# Altium schematic sheet SWDM-21DD8_LV_XX_V1.SchDoc
size 419 x 297 mm
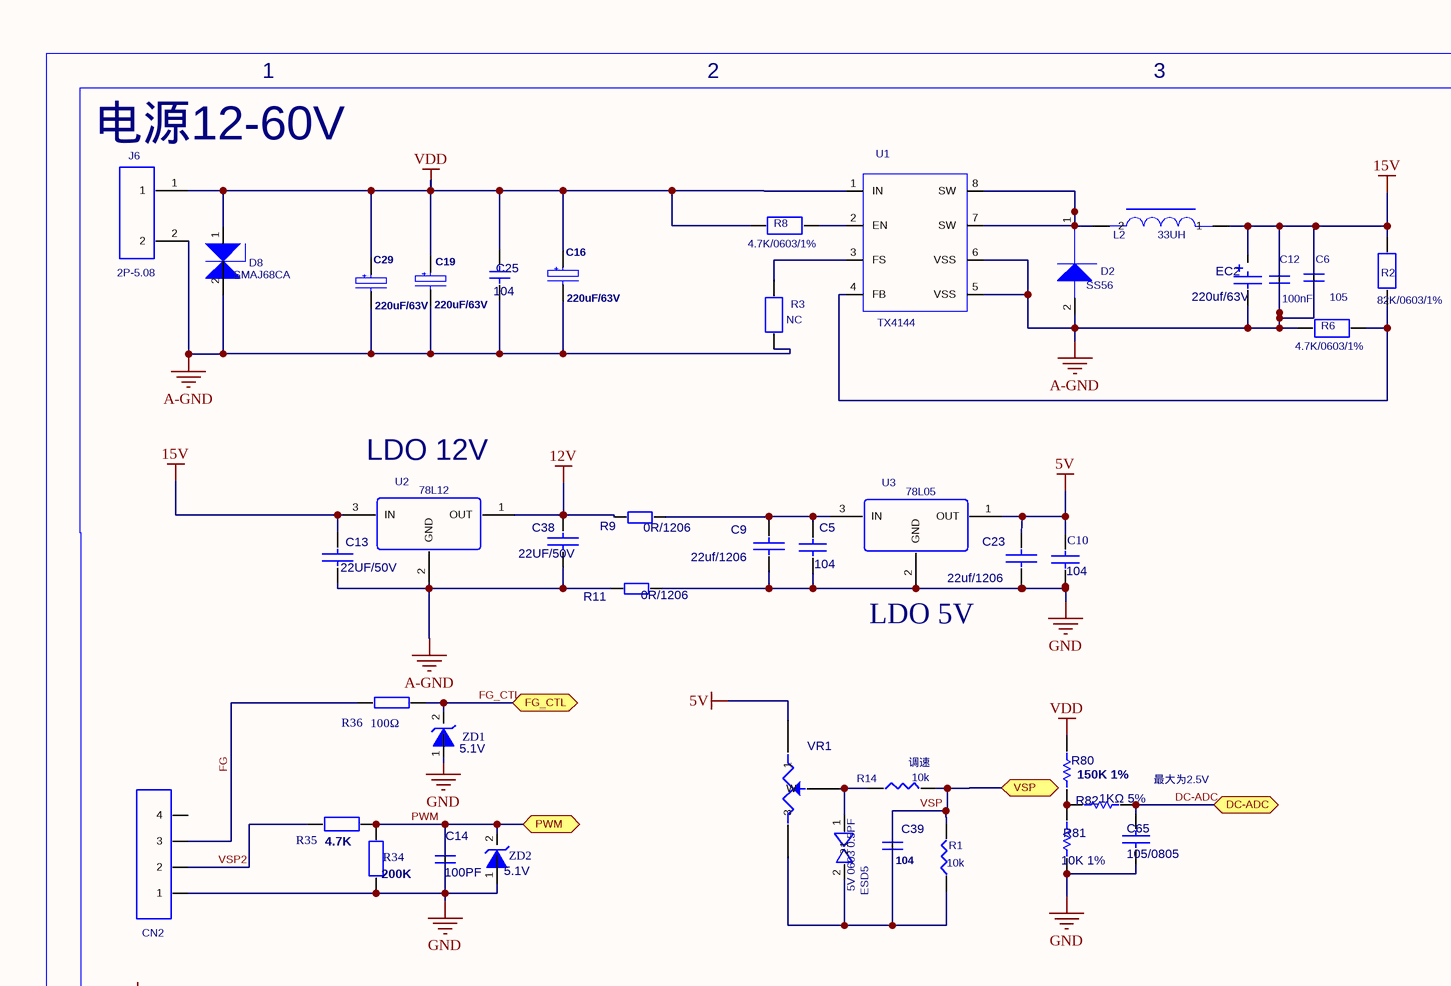
[diagram p0: SWDM-21DD8_LV_XX_V1.SchDoc, top left]
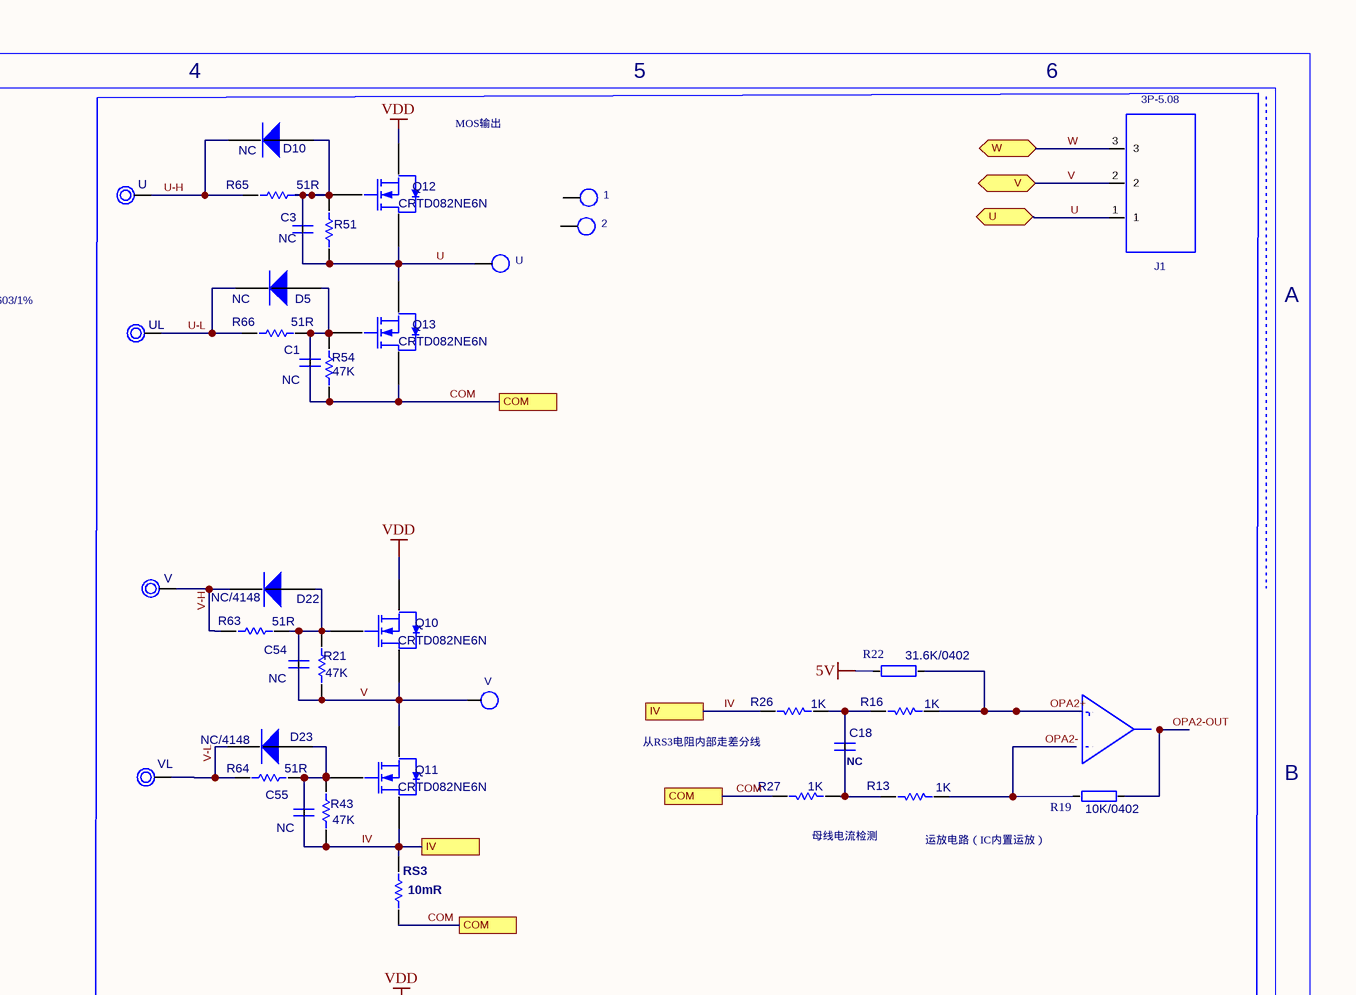
[diagram p1: SWDM-21DD8_LV_XX_V1.SchDoc, top right]
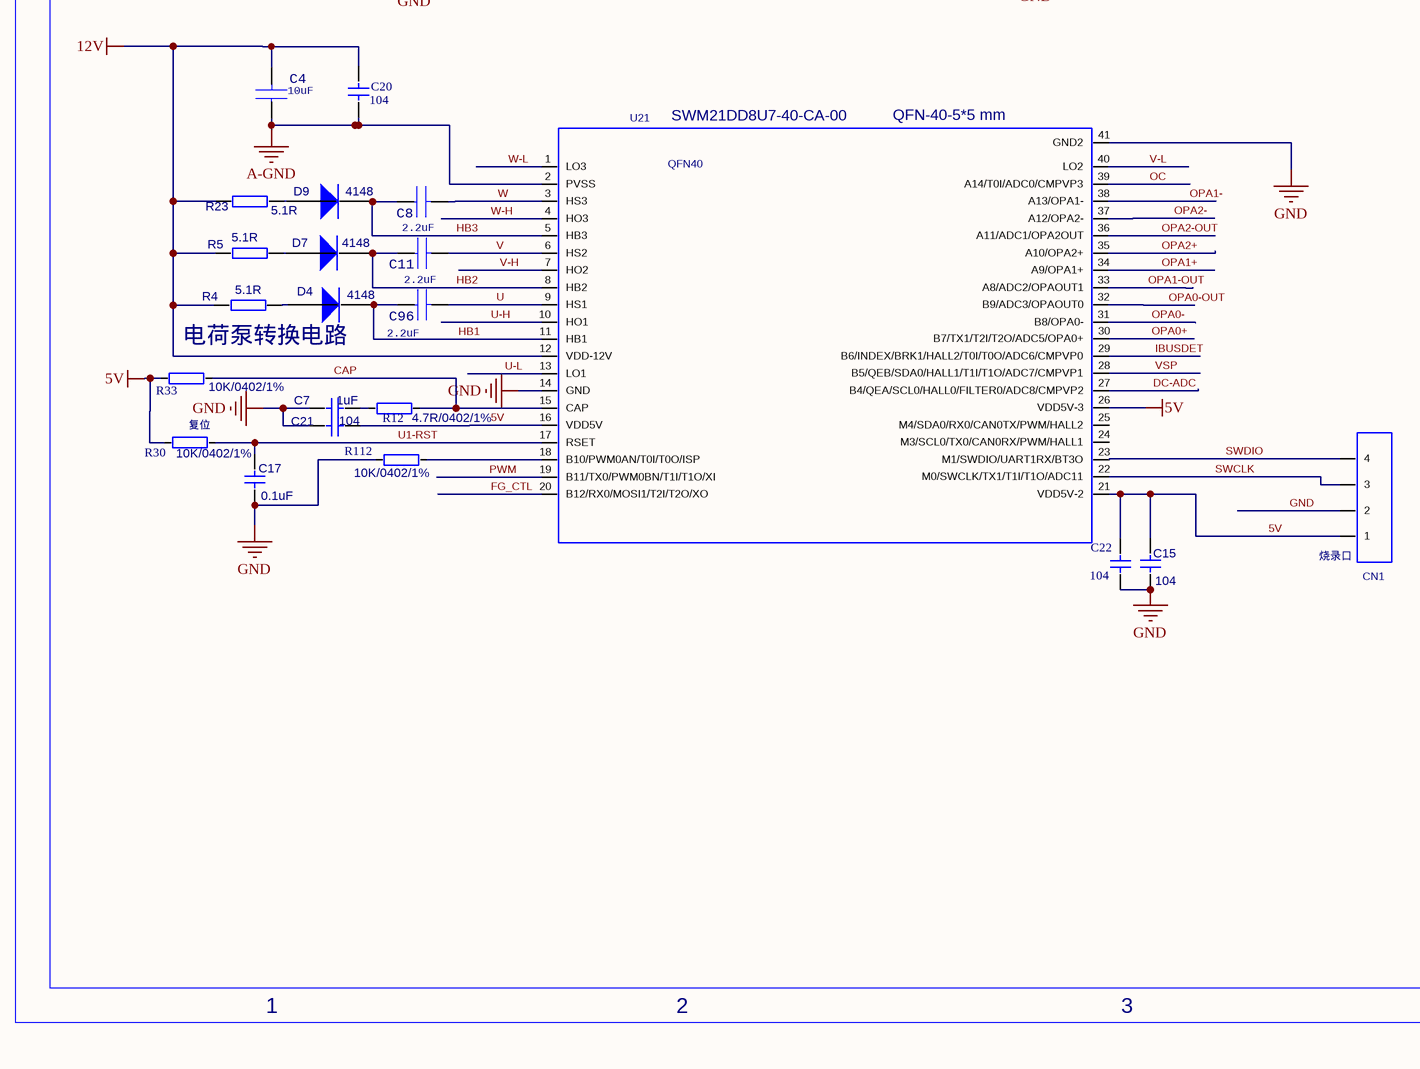
[diagram p2: SWDM-21DD8_LV_XX_V1.SchDoc, bottom left]
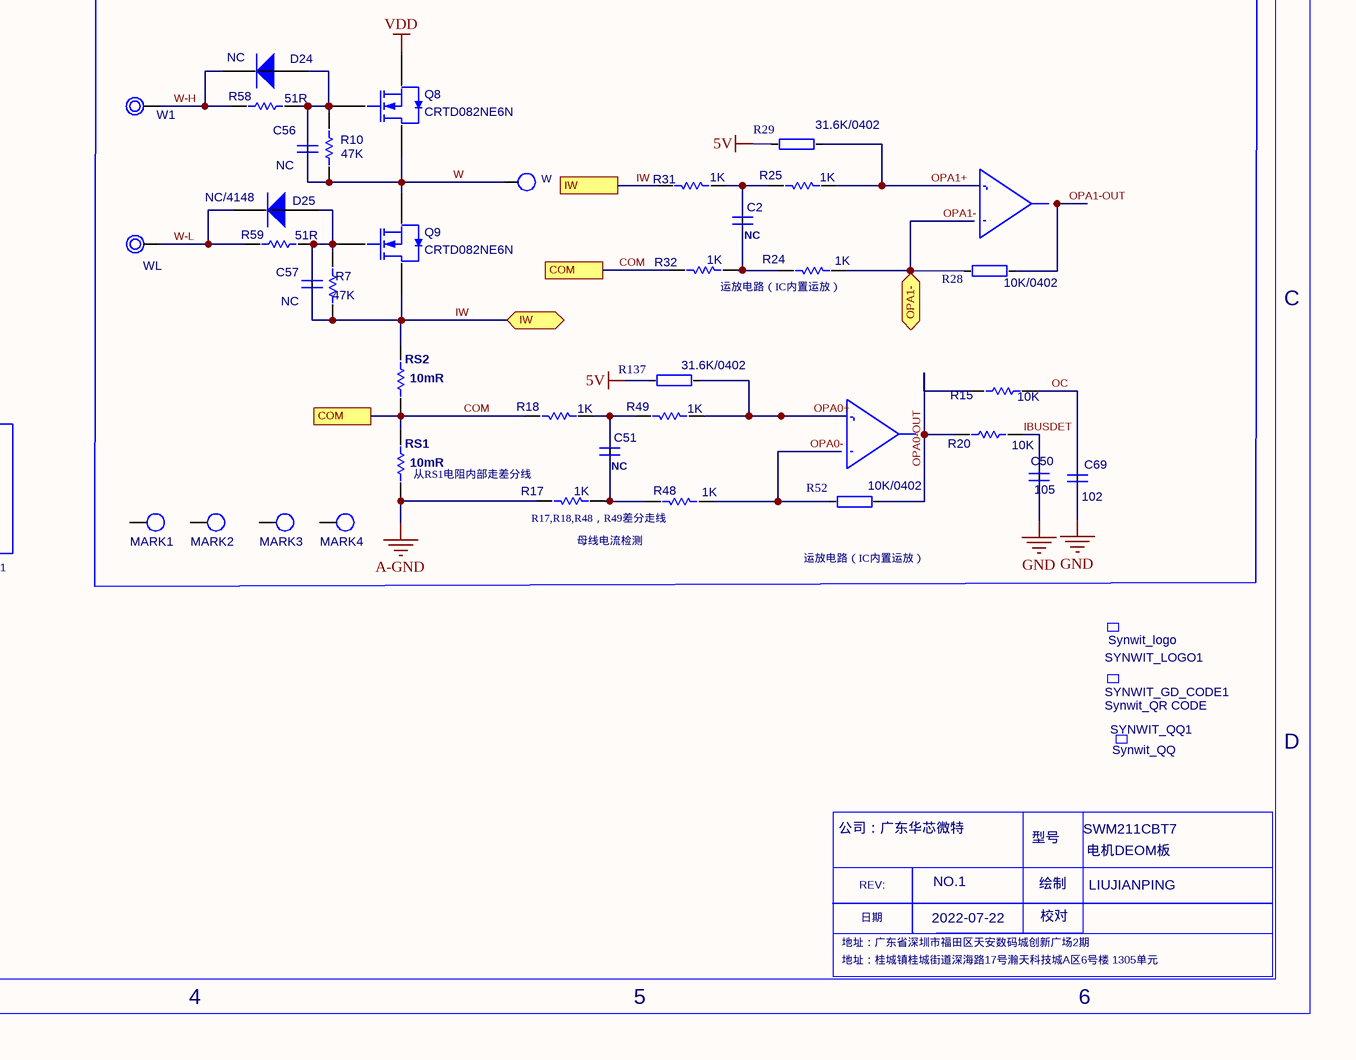
[diagram p3: SWDM-21DD8_LV_XX_V1.SchDoc, bottom right]

## Parts
C1  NC  [C0603]
C2  value NC  [C0603]  (hidden comment: C0603)
C3  NC  [C0603]
C4  value 10uF  [C0805]  (hidden comment: 22uf/25v)
C5  104  [C0603]
C6  value 105  [C0603]  (hidden comment: C0603)
C7  1uF  [C0603]
C8  value 2.2uF  [C0805]  (hidden comment: C0805)
C9  22uf/1206  [C1206]
C10  104  [C0603]
C11  value 2.2uF  [C0805]  (hidden comment: C0805)
C12  value 100nF  [C0603]  (hidden comment: C0603)
C13  22UF/50V  [C1206]
C14  100PF  [C0603]
C15  104  [C0603]
C16  value 220uF/63V  [CAP_10X12]  (hidden comment: CAP_10X12)
C17  0.1uF  [C0603]
C18  value NC  [C0603]  (hidden comment: C0603)
C19  value 220uF/63V  [CAP_10X12]  (hidden comment: CAP_10X12)
C20  104  [C0603]
C21  104  [C0603]
C22  104  [C0603]
C23  22uf/1206  [C1206]
C25  104  [C0603]
C29  value 220uF/63V  [CAP_10X12]  (hidden comment: CAP_10X12)
C38  22UF/50V  [C1206]
C39  value 104  [C0603]  (hidden comment: C0603)
C50  105  [C0603]
C51  value NC  [C0603]  (hidden comment: C0603)
C54  NC  [C0603]
C55  NC  [C0603]
C56  NC  [C0603]
C57  NC  [C0603]
C65  105/0805  [C0603]
C69  102  [C0603]
C96  value 2.2uF  [C0805]  (hidden comment: C0805)
CN1  SWD1  [4P-2.54-8]  (value not drawn)
CN2  SWD1  [4P-2.54-8]  (value not drawn)
D2  value SS56  [SMA]  (hidden comment: DIODE_2)
D4  4148  [SOD-123/3]
D5  NC  [SOD-323]
D7  4148  [SOD-123/3]
D8  value SMAJ68CA  [Y_SMA-TVS]  (hidden comment: DIODE_4)
D9  4148  [SOD-123/3]
D10  NC  [SOD-323]
D22  NC/4148  [SOD-323]
D23  NC/4148  [SOD-323]
D24  NC  [SOD-323]
D25  NC/4148  [SOD-323]
EC2  220uf/63V  [C-DD6X9]
ESD5  value 5V 0603 0.5PF  [ESD0603]  (hidden comment: ESD0603)
J1  3P-5.08  [3P-5.08]
J6  2P-5.08  [2P-5.08]
L2  value 33UH  [L-8050]  (hidden comment: L-8050)
MARK1  TEST POINT  [TP60]  (value not drawn)
MARK2  TEST POINT  [TP60]  (value not drawn)
MARK3  TEST POINT  [TP60]  (value not drawn)
MARK4  TEST POINT  [TP60]  (value not drawn)
Q8  CRTD082NE6N  [TO-252-2-180]
Q9  CRTD082NE6N  [TO-252-2-180]
Q10  CRTD082NE6N  [TO-252-2-180]
Q11  CRTD082NE6N  [TO-252-2-180]
Q12  CRTD082NE6N  [TO-252-2-180]
Q13  CRTD082NE6N  [TO-252-2-180]
R1  10K  [R0603]
R2  82K/0603/1%  [R0603]
R3  NC  [R0603]
R4  5.1R  [R1206]
R5  5.1R  [R1206]
R6  4.7K/0603/1%  [R0603]
R7  47K  [R0603]
R8  4.7K/0603/1%  [R0603]
R9  0R/1206  [1206R]
R10  47K  [R0603]
R11  0R/1206  [1206R]
R12  4.7R/0402/1%  [R0603]
R13  1K  [R0603]
R14  10K  [R0603]
R15  10K  [R0603]
R16  1K  [R0603]
R17  1K  [R0603]
R18  1K  [R0603]
R19  10K/0402  [R0603]
R20  10K  [R0603]
R21  47K  [R0603]
R22  31.6K/0402  [R0603]
R23  5.1R  [R1206]
R24  1K  [R0603]
R25  1K  [R0603]
R26  1K  [R0603]
R27  1K  [R0603]
R28  10K/0402  [R0603]
R29  31.6K/0402  [R0603]
R30  10K/0402/1%  [R0603]
R31  1K  [R0603]
R32  1K  [R0603]
R33  10K/0402/1%  [R0603]
R34  200K  [R0603]
R35  4.7K  [R0603A]
R36  100Ω  [R0603]
R43  47K  [R0603]
R48  1K  [R0603]
R49  1K  [R0603]
R51  47K  [R0603]  (value not drawn)
R52  10K/0402  [R0603]
R54  47K  [R0603]
R58  51R  [R0603]
R59  51R  [R0603]
R63  51R  [R0603]
R64  51R  [R0603]
R65  51R  [R0603]
R66  51R  [R0603]
R80  150K 1%  [R0603]
R81  10K 1%  [R0603]
R82  1KΩ 5%  [R0603]
R112  10K/0402/1%  [R0603]
R137  31.6K/0402  [R0603]
RS1  10mR  [2512R_6332]
RS2  10mR  [2512R_6332]
RS3  10mR  [2512R_6332]
SYNWIT_GD_CODE1  Synwit_QR CODE  [SYNWIT_GD_QR_CODE]
SYNWIT_LOGO1  Synwit_logo  [SYNWIT_LOGO_14X7]
SYNWIT_QQ1  Synwit_QQ  [SYNWIT_QQ]
T1  value U  [TEST]  (hidden comment: TEST)
T2  value 1  [TEST]  (hidden comment: TEST)
T3  value V  [TEST]  (hidden comment: TEST)
T4  value W  [TEST]  (hidden comment: TEST)
T6  value 2  [TEST]  (hidden comment: TEST)
U  TP_1  [TP60]  (value not drawn)
U1  TX4144  [SOP8]
U2  78L12  [78L05]
U3  78L05  [78L05]
U21  QFN40  [QFN40]
UL  TP_1  [TP60]  (value not drawn)
V  TP_1  [TP60]  (value not drawn)
VL  TP_1  [TP60]  (value not drawn)
VR1  (no value)  [VR6]
W1  TP_1  [TP60]  (value not drawn)
WL  TP_1  [TP60]  (value not drawn)
ZD1  5.1V  [SOD-123]
ZD2  5.1V  [SOD-123]

## Ports
COM, DC-ADC (bidir), FG_CTL (bidir), IV, IW, IW (bidir), OPA1- (bidir), PWM (bidir), U (bidir), V (bidir), VSP (bidir), W (bidir)

## Nets
5V: C10.2 C15.2 C21.1 C22.2 C23.2 CN1.1 R22.2 R29.2 R30.1 R33.1 R137.2 U3.1(OUT) U21.16(VDD5V) U21.21(VDD5V-2) U21.26(VDD5V-3) VR1.1
12V: C4.2 C20.2 C38.1 R4.1 R5.1 R9.1 R23.1 U2.1(OUT) U21.12(VDD-12V)
15V: C6.2 C12.2 C13.1 EC2.1 L2.1 R2.1 U2.3(IN)
A-GND: C4.1 C6.1 C12.1 C13.2 C16.2 C19.2 C20.1 C25.1 C29.2 C38.2 D2.2(ANODE) D8.2(ANODE) EC2.2 J6.2 R3.2 R6.2 R11.1 R17.1 RS1.1 U1.5(VSS) U1.6(VSS) U2.2(GND) U21.2(PVSS)
GND: C5.1 C7.1 C9.1 C10.1 C14.2 C15.1 C17.2 C21.2 C22.1 C23.1 C50.1 C65.2 C69.1 CN1.2 CN2.1 R11.2 R34.2 R81.2 R112.2 U3.2(GND) U21.14(GND) U21.41(GND2) ZD1.1 ZD2.1
VDD: C16.1 C19.1 C25.2 C29.1 D8.1(CATHODE) J6.1 Q8.2(S) Q10.2(S) Q12.2(S) R8.2 R80.2 U1.1(IN)
CAP: R12.2 R33.2 U21.15(CAP)
COM: C1.1 Q13.3(D) R18.1 R27.1 R32.1 R54.1 RS1.2 RS2.1 RS3.1 ; port COM
DC-ADC: C65.1 R82.1 U21.27(B4/QEA/SCL0/HALL0/FILTER0/ADC8/CMPVP2) ; port DC-ADC
FG: CN2.3 R36.2
FG_CTL: R36.1 U21.20(B12/RX0/MOSI1/T2I/T2O/XO) ZD1.2 ; port FG_CTL
HB1: C96.1 D4.2(K) U21.11(HB1)
HB2: C11.1 D7.2(K) U21.8(HB2)
HB3: C8.1 D9.2(K) U21.5(HB3)
IBUSDET: C50.2 R20.2 U21.29(B6/INDEX/BRK1/HALL2/T0I/T0O/ADC6/CMPVP0)
IV: C55.1 Q11.3(D) R26.1 R43.1 RS3.2 ; port IV
IW: C57.1 Q9.3(D) R7.1 R31.1 RS2.2 ; port IW
OC: C69.2 R15.2 U21.39(A14/T0I/ADC0/CMPVP3)
OPA0+: R49.2 R137.1 U21.30(B7/TX1/T2I/T2O/ADC5/OPA0+)
OPA0-: R48.2 R52.2 U21.31(B8/OPA0-)
OPA0-OUT: R15.1 R20.1 R52.1 U21.32(B9/ADC3/OPAOUT0)
OPA1+: R25.2 R29.1 U21.34(A9/OPA1+)
OPA1-: R24.2 R28.2 U21.38(A13/OPA1-) ; port OPA1-
OPA1-OUT: R28.1 U21.33(A8/ADC2/OPAOUT1)
OPA2+: R16.2 R22.1 U21.35(A10/OPA2+)
OPA2-: R13.2 R19.2 U21.37(A12/OPA2-)
OPA2-OUT: R19.1 U21.36(A11/ADC1/OPA2OUT)
PWM: C14.1 R34.1 R35.2 U21.19(B11/TX0/PWM0BN/T1I/T1O/XI) ZD2.2 ; port PWM
SWCLK: CN1.3 U21.22(M0/SWCLK/TX1/T1I/T1O/ADC11)
SWDIO: CN1.4 U21.23(M1/SWDIO/UART1RX/BT3O)
U: C3.1 C96.2 J1.1 Q12.3(D) Q13.2(S) R51.1 T1.1 U21.9(HS1) ; port U
U1-RST: C17.1 R30.2 U21.17(RSET)
U-H: D10.2(K) R65.1 U.1 U21.10(HO1)
U-L: D5.2(K) R66.1 U21.13(LO1) UL.1
V: C11.2 C54.1 J1.2 Q10.3(D) Q11.2(S) R21.1 T3.1 U21.6(HS2) ; port V
V-H: D22.2(K) R63.1 U21.7(HO2) V.1
V-L: D23.2(K) R64.1 U21.40(LO2) VL.1
VSP: C39.1 R1.1 R14.1 U21.28(B5/QEB/SDA0/HALL1/T1I/T1O/ADC7/CMPVP1) ; port VSP
VSP2: CN2.2 R35.1
W: C8.2 C56.1 J1.3 Q8.3(D) Q9.2(S) R10.1 T4.1 U21.3(HS3) ; port W
W-H: D24.2(K) R58.1 U21.4(HO3) W1.1
W-L: D25.2(K) R59.1 U21.1(LO3) WL.1
NetC1_2: C1.2 D5.1(A) Q13.1(G) R54.2 R66.2
NetC2_1: C2.1 R25.1 R31.2
NetC2_2: C2.2 R24.1 R32.2
NetC3_2: C3.2 D10.1(A) Q12.1(G) R51.2 R65.2
NetC5_2: C5.2 C9.2 R9.2 U3.3(IN)
NetC7_2: C7.2 R12.1
NetC18_1: C18.1 R16.1 R26.2
NetC18_2: C18.2 R13.1 R27.2
NetC39_2: C39.2 ESD5.2 R1.2 VR1.3
NetC51_1: C51.1 R18.2 R49.1
NetC51_2: C51.2 R17.2 R48.1
NetC54_2: C54.2 D22.1(A) Q10.1(G) R21.2 R63.2
NetC55_2: C55.2 D23.1(A) Q11.1(G) R43.2 R64.2
NetC56_2: C56.2 D24.1(A) Q8.1(G) R10.2 R58.2
NetC57_2: C57.2 D25.1(A) Q9.1(G) R7.2 R59.2
NetD2_1: D2.1(CATHODE) L2.2 U1.7(SW) U1.8(SW)
NetD4_1: D4.1(A) R4.2
NetD7_1: D7.1(A) R5.2
NetD9_1: D9.1(A) R23.2
NetESD5_1: ESD5.1 R14.2 VR1.W
NetR2_2: R2.2 R6.1 U1.4(FB)
NetR3_1: R3.1 U1.3(FS)
NetR8_1: R8.1 U1.2(EN)
NetR80_1: R80.1 R81.1 R82.2
NetR112_1: R112.1 U21.18(B10/PWM0AN/T0I/T0O/ISP)

Not connected (* = marked no-connect by the designer): CN2 4; MARK1 1; MARK2 1; MARK3 1; MARK4 1; T2 1; T6 1; U21 24(M3/SCL0/TX0/CAN0RX/PWM/HALL1) 25(M4/SDA0/RX0/CAN0TX/PWM/HALL2)

## Notes on the sheet
- (near J6) 电源12-60V
- 1
- 2
- 3
- 4
- MOS输出
- 5
- 6
- A
- (near U2) LDO 12V
- LDO 5V
- 从RS3电阻内部走差分线
- (near R14) 调速
- 最大为2.5V
- (near R27) 母线电流检测
- B
- (near R13) 运放电路（IC内置运放）
- (near U21) SWM21DD8U7-40-CA-00
- (near U21) QFN-40-5*5 mm
- 运放电路（IC内置运放）
- C
- 电荷泵转换电路
- (near R30) 复位
- (near RS1) 从RS1电阻内部走差分线
- (near CN1) 烧录口
- (near R17) R17,R18,R48，R49差分走线
- (near R17) 母线电流检测
- (near R52) 运放电路（IC内置运放）
- D
- 公司：广东华芯微特
- SWM211CBT7
- REV:
- 日期
- 2022-07-22
- NO.1
- 型号
- 绘制
- 校对
- 电机DEOM板
- LIUJIANPING
- 地址：桂城镇桂城街道深海路17号瀚天科技城A区6号楼 1305单元
- 地址：广东省深圳市福田区天安数码城创新广场2期

## Library data of the parts
C1 C3 C50 C54-C57 C69 = C0603: 贴片瓷片电容; Value: 100nF; Published: 8-Jun-2000; LatestRevisionDate: 17-Jul-2002; LatestRevisionNote: Re-released for DXP Platform.; PackageReference: RAD-0.3; Publisher: Altium Limited; PCB DECAL: C0603; Comment_1: C0603
C4 = C0805: SMT Resistor 5% UniOhm(厚声); Part_Shape: 0603; Source_Path: E:\GTCS-A01-SWM-P9项目\GTCS-A01-SWM-P9项目V1.2\GTCS-A01-SWM-P9-V1.2.原理图\99.DSN; ValueRank: 33R; ForPin: Pin; Designator: R1C; Contributor: LCEDA_Lib; Published: 8-Jun-2000; LatestRevisionDate: 17-Jul-2002; LatestRevisionNote: Re-released for DXP Platform.; PackageReference: 0805; Publisher: Altium Limited; PackageDescription: Radial Cap, Thru-Hole; 2 Leads; 0.3 in Pin Spacing; PCB DECAL: C0805; MountType: SMT; Footprint: 0805; Accuracy: 5%; spicePre: R; spiceSymbolName: R_0603_EU; Comment_1: C0805
C5 C10 = CAP_2: 贴片瓷片电容; Value: 100nF; Published: 8-Jun-2000; LatestRevisionDate: 17-Jul-2002; LatestRevisionNote: Re-released for DXP Platform.; PackageReference: RAD-0.3; Publisher: Altium Limited; PCB DECAL: C0603; Comment_1: CAP_2
C7 C15 C17 C20-C22 C25 = CAP_S: PCB DECAL: C0603; Comment_1: CAP_S
C8 C11 C96 = C0805: Part_Shape: 0603; Source_Path: E:\GTCS-A01-SWM-P9项目\GTCS-A01-SWM-P9项目V1.2\GTCS-A01-SWM-P9-V1.2.原理图\99.DSN; PCB DECAL: C0805
C9 C23 = C1206: Capacitor; Value: 100pF; Published: 8-Jun-2000; LatestRevisionDate: 17-Jul-2002; LatestRevisionNote: Re-released for DXP Platform.; PackageReference: RAD-0.3; Publisher: Altium Limited; PackageDescription: Radial Cap, Thru-Hole; 2 Leads; 0.3 in Pin Spacing; PCB DECAL: C1206; Comment_1: C1206
C13 C38 = C1206: 电解电容; PCB DECAL: C1206; Comment_1: C1206
C14 = C0603: Capacitor; Value: 100P; Published: 8-Jun-2000; LatestRevisionDate: 17-Jul-2002; LatestRevisionNote: Re-released for DXP Platform.; PackageReference: RAD-0.3; Publisher: Altium Limited; PackageDescription: Radial Cap, Thru-Hole; 2 Leads; 0.3 in Pin Spacing; PCB DECAL: C0603; Comment_1: C0603
C16 C19 C29 = CAP_10X12: ROOM: IIS; Voltage: 16V; Tolerance: 20%; Material: TAN; Source_Path: E:\WORD\ALLEGRO SPB\MY_LIB\LIBRARY.OLB; PCB DECAL: CAP_10X12; Height: 2.80mm
C65 = CAP: Capacitor; Value: 100pF; Published: 8-Jun-2000; LatestRevisionDate: 17-Jul-2002; LatestRevisionNote: Re-released for DXP Platform.; PackageReference: RAD-0.3; Publisher: Altium Limited; PackageDescription: Radial Cap, Thru-Hole; 2 Leads; 0.3 in Pin Spacing; PCB DECAL: C0603; Comment_1: CAP
CN1 CN2 = 4P-2.54-8: 接插件  DS-5.1CN4  DS-2.54CWB-4; PCB DECAL: 4P-2.54-8; Comment_1: 4P-2.54-8
D2 = DIODE_2: Part_Number: DIO-4148-01; Part_Type: Diode; Source_Path: E:\SMW-190CBT6.DSN; PCB DECAL: SMA
D4 D5 D7 D9 D22-D25 = DIODE: Default Diode; Published: 8-Jun-2000; LatestRevisionDate: 17-Jul-2002; LatestRevisionNote: Re-released for DXP Platform.; PackageVersion: Sep-1996; PackageReference: SMC; Publisher: Altium Limited; PackageDescription: DO-214-AB/SMC; 2 C-Bend Leads; Body 7.9 x 5.9 mm, inc. leads (LxW); Code_JEDEC: DO-214-AB; Comment_1: DIODE
  D4 D7 D9: PCB DECAL: SOD-123/3
  D5 D22-D25: PCB DECAL: SOD-323
D8 = DIODE_4: Part_Number: DIO-4148-01; Part_Type: Diode; Source_Path: E:\SMW190CBT6666.DSN; PCB DECAL: Y_SMA-TVS
D10 = DIODE: Default Diode; ROOM: 1N4148 SOD-323; LatestRevisionDate: 17-Jul-2002; LatestRevisionNote: Re-released for DXP Platform.; PackageDescription: DO-214-AB/SMC; 2 C-Bend Leads; Body 7.9 x 5.9 mm, inc. leads (LxW); Code_JEDEC: DO-214-AB; PCB DECAL: SOD-323; Comment_1: DIODE
EC2 = CAP_POL2: Polarized Capacitor (Axial); Value: 100pF; Published: 8-Jun-2000; LatestRevisionDate: 17-Jul-2002; LatestRevisionNote: Re-released for DXP Platform.; PackageReference: POLAR0.8; Publisher: Altium Limited; PackageDescription: Polarized Capacitor; 2 Leads; PCB DECAL: C-DD6X9; Comment_1: CAP_POL2
L2 = L-8050: Source_Path: C:\USERS\ADMINISTRATOR\DESKTOP\ORCAD元件库\Y-MYLIBRARY.OLB; PCB DECAL: L-8050
MARK1-MARK4 = TEST_POINT: PCB DECAL: TP60; Comment_1: TEST_POINT
Q8-Q13 = AO3400A_NZKDZ_X0YV1T_SOT-23: MOS(场效应管); ComponentLink1URL: http://www.szlcsc.com/product/details_21629.html; Package: SOT-23; Supplier: LC; SuppliersPartNumber: C20917; PCB DECAL: TO-252-2-180; Comment_1: AO3400A_NZKDZ_X0YV1T_SOT-23
R1 R14 = 10K_2: Published: 8-Jun-2000; LatestRevisionDate: 17-Jul-2002; LatestRevisionNote: Re-released for DXP Platform.; PackageReference: AXIAL-0.4; Publisher: Altium Limited; Comment_1: 10k; PCB DECAL: R0603; Comment_1: 10K_2
R2 R3 R6 R8 = R0603: PCB DECAL: R0603; Comment_1: R0603
R4 R5 R23 = RES_T: PCB DECAL: R1206; Comment_1: RES_T
R7 R10 R15 R20 R21 R43 R51 R54 R58 R59 R63-R66 R80-R82 = RES_SEMI: Semiconductor Resistor; Value: 1K; Published: 8-Jun-2000; LatestRevisionDate: 17-Jul-2002; LatestRevisionNote: Re-released for DXP Platform.; PackageReference: AXIAL-0.5; Publisher: Altium Limited; PackageDescription: Axial Device, Thru-Hole; 2 Leads; 0.5 in Pin Spacing; PCB DECAL: R0603; Comment_1: RES_SEMI
R9 R11 = R1206: 贴片 电阻器; PCB DECAL: 1206R; Comment_1: R1206
R12 R19 R22 R28-R30 R33 R52 R137 = R0402: 贴片电阻; Value: 1K; Published: 8-Jun-2000; LatestRevisionDate: 17-Jul-2002; LatestRevisionNote: Re-released for DXP Platform.; Publisher: Altium Limited; PCB DECAL: R0603; Comment_1: R0402
  R12 R30 R33: PackageReference: AXIAL-0.4
  R19 R22 R28 R29 R52 R137: PackageReference: AXIAL-0.5; PackageDescription: Axial Device, Thru-Hole; 2 Leads; 0.5 in Pin Spacing
R13 R16-R18 R24-R27 R31 R32 R48 R49 = RES_SEMI: Semiconductor Resistor; Published: 8-Jun-2000; LatestRevisionDate: 17-Jul-2002; LatestRevisionNote: Re-released for DXP Platform.; PackageReference: AXIAL-0.5; Publisher: Altium Limited; PackageDescription: Axial Device, Thru-Hole; 2 Leads; 0.5 in Pin Spacing; Value: 1K; PCB DECAL: R0603; Comment_1: RES_SEMI
R34 = RES: 电阻, Resistor; Value: 1K; UNNAMED1: 100KΩ±1%; Published: 8-Jun-2000; LatestRevisionDate: 17-Jul-2002; LatestRevisionNote: Re-released for DXP Platform.; PackageReference: AXIAL-0.4; Publisher: Altium Limited; UNNAMED2: 100KΩ±1%; Commen: 200K; PCB DECAL: R0603; Comment_1: RES
R35 = 0603_1KKC_(1001)_1%: 贴片电阻; UNNAMED1: 供应商链接; UNNAMED2: 1KΩ±1%; Commen: 100Ω; ComponentLink1URL: http://www.szlcsc.com/product/details_21904.html; Package: 0603; Supplier: LC; SuppliersPartNumber: C21190; UNNAMED3: 1KΩ±1%; PCB DECAL: R0603A; Comment_1: 0603_1KKC_(1001)_1%
R36 = RES2: PCB DECAL: R0603; Comment_1: RES2
R112 = R0402: 贴片电阻; Value: 10K; PCB DECAL: R0603; Comment_1: R0402
RS1-RS3 = RES_2512: Semiconductor Resistor; Value: 1K; Published: 8-Jun-2000; LatestRevisionDate: 17-Jul-2002; LatestRevisionNote: Re-released for DXP Platform.; PackageReference: AXIAL-0.5; Publisher: Altium Limited; PackageDescription: Axial Device, Thru-Hole; 2 Leads; 0.5 in Pin Spacing; PCB DECAL: 2512R_6332; Comment_1: RES_2512
SYNWIT_GD_CODE1 SYNWIT_QQ1 = SYNWIT_LOGO: Comment_1: SYNWIT_LOGO
  SYNWIT_GD_CODE1: PCB DECAL: SYNWIT_GD_QR_CODE
  SYNWIT_QQ1: PCB DECAL: SYNWIT_QQ
T1-T4 T6 = TEST: Source_Path: C:\USERS\ADMINISTRATOR\DESKTOP\ORCAD元件库\Y-MYLIBRARY.OLB; PCB DECAL: TEST
U1 = TX4144: Source_Path: E:\LIBRARY1.OLB; PCB DECAL: SOP8; Value: TX4144
U2 U3 = 78L05: BOM_Manufacturer: SK; SMT_Type: Extend; BOM_Supplier: LCSC; BOM_Manufacturer_Part: 78L05; BOM_Supplier_Part: C112446; BOM_LCSC_Assembly: Yes; spicePre: U; spiceSymbolName: 78L05; PCB DECAL: 78L05; Comment_1: 78L05
VR1 = RV-3296: Potentiometer; PCB DECAL: VR6; Comment_1: RV-3296
ZD1 ZD2 = DIODE_W: PCB DECAL: SOD-123; Comment_1: DIODE_W
C2 C6 C12 C18 C39 C51 = C0603: PCB DECAL: C0603
ESD5 = ESD0603: PCB DECAL: ESD0603
J1 = 3P-5.08: PCB DECAL: 3P-5.08
J6 = 2P-5.08: PCB DECAL: 2P-5.08
SYNWIT_LOGO1 = SYNWIT_LOGO: PCB DECAL: SYNWIT_LOGO_14X7; Comment_1: SYNWIT_LOGO
U UL V VL W1 WL = TP_1: PCB DECAL: TP60; Comment_1: TP_1
U21 = QFN40: PCB DECAL: QFN40